# Altium project Variable_resistance_plates.PrjPcb
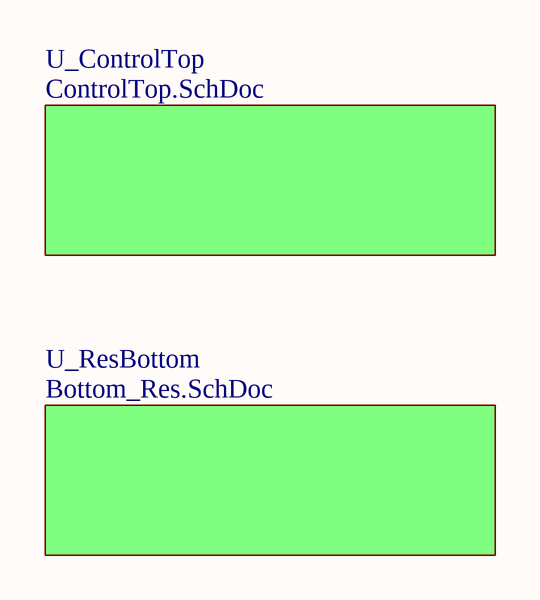
[diagram p0: All.SchDoc]
7 sheets, 187 parts. Net scope: hierarchical (ports join the sheet entries above them; power ports are global).
Board file: TopControl.PcbDoc
Sheets:
  All.SchDoc
    U_ControlTop = ControlTop.SchDoc
      U_MCU = MCU.SchDoc
      U_Power = Power.SchDoc
      Relay1 = Relay.SchDoc
      Relay2 = Relay.SchDoc
      Relay3 = Relay.SchDoc
      Relay4 = Relay.SchDoc
      Relay5 = Relay.SchDoc
      Relay6 = Relay.SchDoc
      Relay7 = Relay.SchDoc
      Relay8 = Relay.SchDoc
      U_Port = Port.SchDoc
    U_ResBottom = Bottom_Res.SchDoc

## Sheet All.SchDoc
size A4; SheetNumber: 1; SheetTotal: 7

### Sub-sheets
U_ControlTop = ControlTop.SchDoc: no entries
U_ResBottom = Bottom_Res.SchDoc: no entries

## Sheet ControlTop.SchDoc
size A4; SheetNumber: 2; SheetTotal: 8
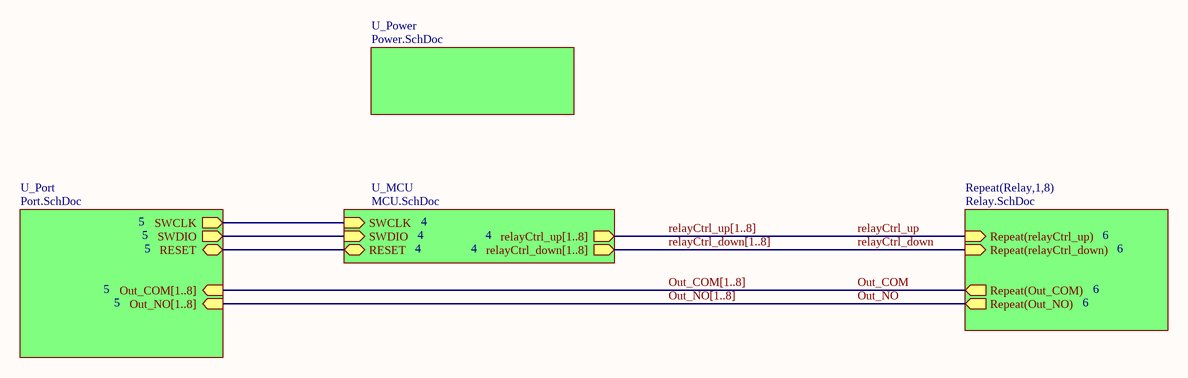
[diagram p1: ControlTop.SchDoc]

### Sub-sheets
Repeat(Relay,1,8) = Relay.SchDoc: Repeat(Out_COM) (out), Repeat(Out_NO) (out), Repeat(relayCtrl_up) (in), Repeat(relayCtrl_down) (in)
U_MCU = MCU.SchDoc: SWDIO (in), SWCLK (in), RESET (bidir), relayCtrl_up[1..8] (out), relayCtrl_down[1..8] (out)
U_Port = Port.SchDoc: SWCLK (out), SWDIO (out), RESET (bidir), Out_NO[1..8] (in), Out_COM[1..8] (in)
U_Power = Power.SchDoc: no entries

### Nets
Out_COM: sheet Repeat(Relay,1,8)/Repeat(Out_COM)
Out_NO: sheet Repeat(Relay,1,8)/Repeat(Out_NO)
relayCtrl_down: sheet Repeat(Relay,1,8)/Repeat(relayCtrl_down)
relayCtrl_up: sheet Repeat(Relay,1,8)/Repeat(relayCtrl_up)
RESET: sheet U_MCU/RESET, sheet U_Port/RESET
SWCLK: sheet U_MCU/SWCLK, sheet U_Port/SWCLK
SWDIO: sheet U_MCU/SWDIO, sheet U_Port/SWDIO

### Buses and harness runs
bus Out_COM[1..8] = sheet U_Port/Out_COM[1..8]
bus Out_NO[1..8] = sheet U_Port/Out_NO[1..8]
bus relayCtrl_down[1..8] = sheet U_MCU/relayCtrl_down[1..8]
bus relayCtrl_up[1..8] = sheet U_MCU/relayCtrl_up[1..8]

## Sheet MCU.SchDoc
size A4; SheetNumber: 4; SheetTotal: 8
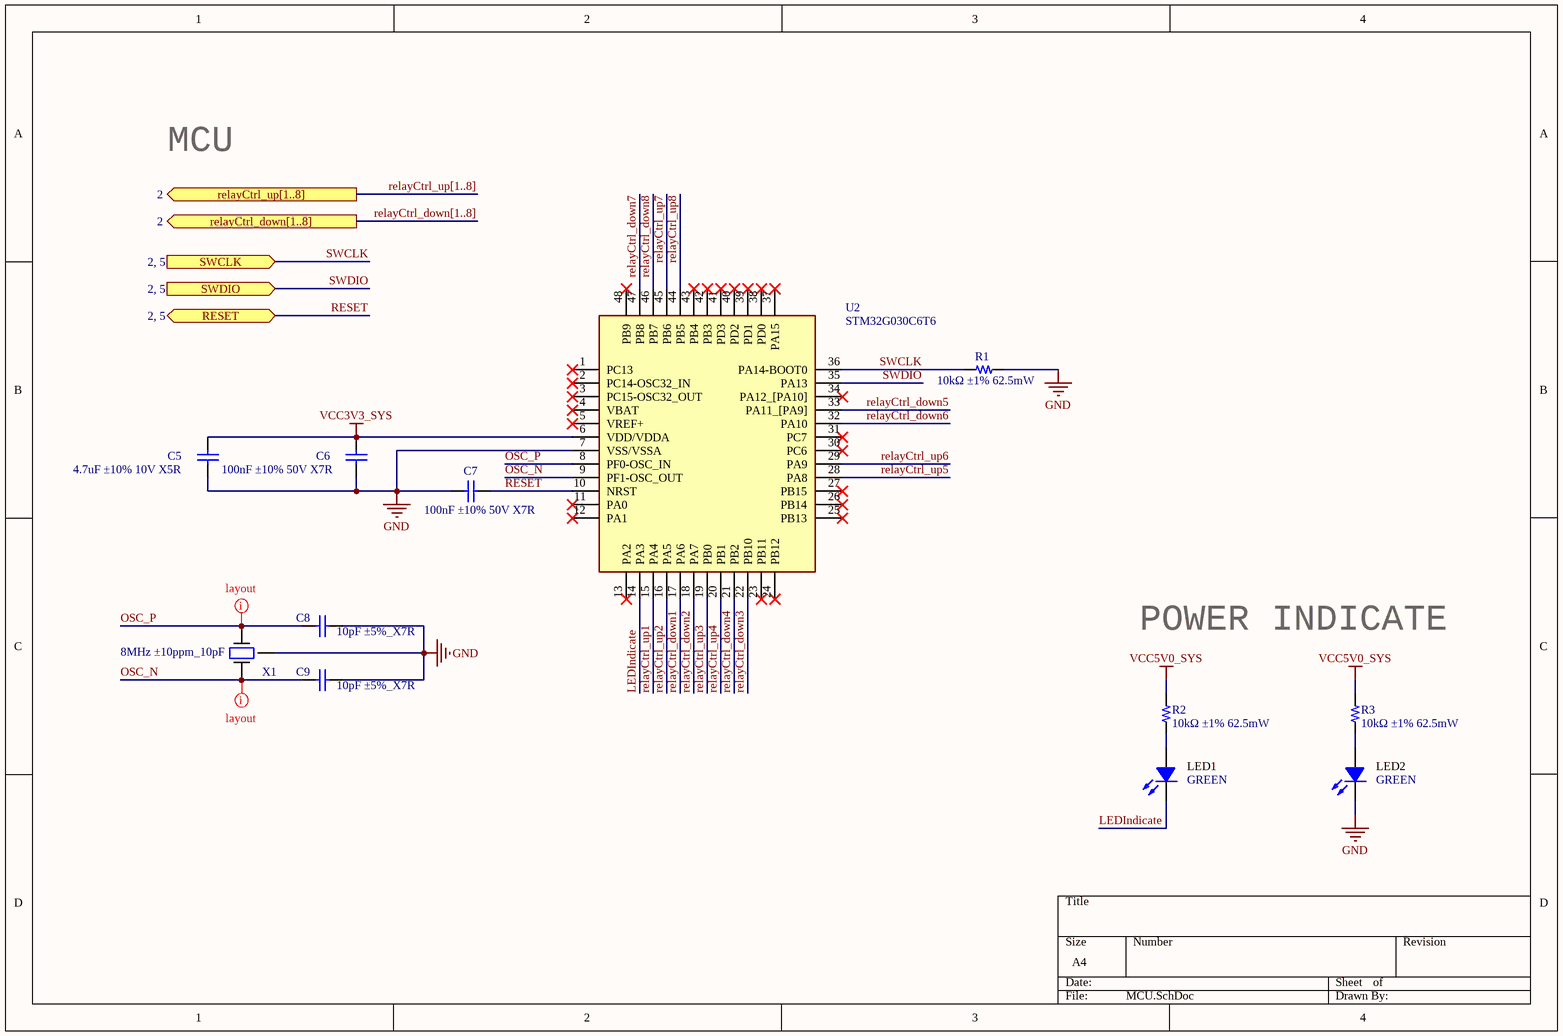
[diagram p2: MCU.SchDoc]

### Parts
C5  4.7uF ±10% 10V X5R  [C0402]
C6  100nF ±10% 50V X7R  [C0402]
C7  100nF ±10% 50V X7R  [C0402]
C8  10pF ±5%_X7R  [C0402]
C9  10pF ±5%_X7R  [C0402]
LED1  GREEN  [LED0603-RD]
LED2  GREEN  [LED0603-RD]
R1  10kΩ ±1% 62.5mW  [R0402]
R2  10kΩ ±1% 62.5mW  [R0402]
R3  10kΩ ±1% 62.5mW  [R0402]
U2  STM32G030C6T6  [QFP50P900X900X160-48N]
X1  8MHz ±10ppm_10pF  [CRYSTAL_3225]

### Ports
relayCtrl_down[1..8] (out, see 2), relayCtrl_up[1..8] (out, see 2), RESET (bidir, see 2, 5), SWCLK (in, see 2, 5), SWDIO (in, see 2, 5)

### Nets
GND: C5.1 C6.1 C7.1 C8.2 C9.2 LED2.2(K) R1.1 U2.7(VSS/VSSA) X1.G
VCC3V3_SYS: C5.2 C6.2 U2.6(VDD/VDDA)
VCC5V0_SYS: R2.1 R3.1
LEDIndicate: LED1.2(K) U2.14(PA3)  [project net LEDIndicate_4]
OSC_N: C9.1 U2.9(PF1-OSC_OUT) X1.1  [project net OSC_N_4]
OSC_P: C8.1 U2.8(PF0-OSC_IN) X1.3  [project net OSC_P_4]
relayCtrl_down1: U2.17(PA6)  [project net relayCtrl_down]
relayCtrl_down2: U2.18(PA7)  [project net relayCtrl_down]
relayCtrl_down3: U2.22(PB10)  [project net relayCtrl_down]
relayCtrl_down4: U2.21(PB2)  [project net relayCtrl_down]
relayCtrl_down5: U2.33(PA11_[PA9])  [project net relayCtrl_down]
relayCtrl_down6: U2.32(PA10)  [project net relayCtrl_down]
relayCtrl_down7: U2.47(PB8)  [project net relayCtrl_down]
relayCtrl_down8: U2.46(PB7)  [project net relayCtrl_down]
relayCtrl_up1: U2.15(PA4)  [project net relayCtrl_up]
relayCtrl_up2: U2.16(PA5)  [project net relayCtrl_up]
relayCtrl_up3: U2.19(PB0)  [project net relayCtrl_up]
relayCtrl_up4: U2.20(PB1)  [project net relayCtrl_up]
relayCtrl_up5: U2.28(PA8)  [project net relayCtrl_up]
relayCtrl_up6: U2.29(PA9)  [project net relayCtrl_up]
relayCtrl_up7: U2.45(PB6)  [project net relayCtrl_up]
relayCtrl_up8: U2.44(PB5)  [project net relayCtrl_up]
RESET: C7.2 U2.10(NRST) ; port RESET
SWCLK: R1.2 U2.36(PA14-BOOT0) ; port SWCLK
SWDIO: U2.35(PA13) ; port SWDIO
NetLED1_1: LED1.1(A) R2.2
NetLED2_1: LED2.1(A) R3.2

Not connected (* = marked no-connect by the designer): U2 1(PC13)* 2(PC14-OSC32_IN)* 3(PC15-OSC32_OUT)* 4(VBAT)* 5(VREF+)* 11(PA0)* 12(PA1)* 13(PA2)* 23(PB11)* 24(PB12)* 25(PB13)* 26(PB14)* 27(PB15)* 30(PC6)* 31(PC7)* 34(PA12_[PA10])* 37(PA15)* 38(PD0)* 39(PD1)* 40(PD2)* 41(PD3)* 42(PB3)* 43(PB4)* 48(PB9)*

### Buses and harness runs
bus relayCtrl_down[1..8] = port relayCtrl_down[1..8]
bus relayCtrl_up[1..8] = port relayCtrl_up[1..8]

### Layout directives
mark named layout: OSC_N_4, OSC_P_4

### Notes on the sheet
- MCU
- POWER INDICATE

### Library data of the parts
C5 = Cap: CL05A475KP5NRNC; Published: 8-Jun-2000; LatestRevisionDate: 17-Jul-2002; LatestRevisionNote: Re-released for DXP Platform.; PackageReference: RAD-0.3; Publisher: Altium Limited; PackageDescription: Radial Cap, Thru-Hole; 2 Leads; 0.3 in Pin Spacing
C6 C7 = Cap: CL05B104KO5NNNC; Published: 8-Jun-2000; LatestRevisionDate: 17-Jul-2002; LatestRevisionNote: Re-released for DXP Platform.; PackageReference: RAD-0.3; Publisher: Altium Limited; PackageDescription: Radial Cap, Thru-Hole; 2 Leads; 0.3 in Pin Spacing
C8 C9 = Cap: Capacitor; Published: 8-Jun-2000; LatestRevisionDate: 17-Jul-2002; LatestRevisionNote: Re-released for DXP Platform.; PackageReference: RAD-0.3; Publisher: Altium Limited; PackageDescription: Radial Cap, Thru-Hole; 2 Leads; 0.3 in Pin Spacing
LED1 LED2 = LED: 发光颜色:; Manufacturer: EVERLIGHT(亿光); Name: 17-21SURC/S530-A2/TR8; Add into BOM: yes; Emitted Color: 红灯; Symbol: 17-21SURC/S530-A2/TR8; Device: 17-21SURC/S530-A2/TR8; LCSC Part Name: 红灯; Supplier Part: C131244; Manufacturer Part: 17-21SURC/S530-A2/TR8; Supplier Footprint: 0805; JLCPCB Part Class: Extended Part; Datasheet: https://atta.szlcsc.com/upload/public/pdf/source/20170918/C131244_1505726880590976254.pdf; Supplier: LCSC; Convert to PCB: yes
R1-R3 = R-0603: 0402WGF1002TCE
U2 = STM32G030C6T6: Integrated Circuit; Manufacturer_Name: STMicroelectronics; Datasheet Link: https://datasheet.datasheetarchive.com/originals/distributors/Datasheets_SAMA/41d698f2d3eefcd1331311559e90da5e.pdf; Height: 1.6mm; Manufacturer_Part_Number: STM32G030C6T6; Mouser Part Number: 511-STM32G030C6T6; Mouser Price/Stock: https://www.mouser.co.uk/ProductDetail/STMicroelectronics/STM32G030C6T6?qs=uwxL4vQweFNhONHhoas%2FMg%3D%3D; Arrow Part Number: STM32G030C6T6; Arrow Price/Stock: https://www.arrow.com/en/products/stm32g030c6t6/stmicroelectronics?utm_currency=USD&region=nac
X1 = CRYSTAL: Crystal 8MHz ±10ppm 10pF 200 Ohm -10°C ~ 60°C Surface Mount 4-SMD, No Lead (DFN, LCC); Manufacturer: Abracon LLC; Manufacturer Part Number: ABM3B-8.000MHZ-10-1-U-T; Operating Mode: Fundamental; Supplier 1: Digi-Key; Supplier Part Number 1: 535-9721-1-ND; RoHS: RoHS Compliant; Category: Crystals, Oscillators, Resonators; Stock: 35437; Pricing 1: 1=0.69, 10=0.578, 50=0.5198, 100=0.462, 500=0.4389 (USD); Packaging: Cut Tape (CT); Part Status: Active; Type: MHz Crystal; Frequency Stability: ±10ppm; Frequency Tolerance: ±10ppm; Load Capacitance: 10pF; Operating Temperature: -10°C ~ 60°C; Ratings: -; Mounting Type: Surface Mount; Package / Case: 4-SMD, No Lead; Size / Dimension: 0.197" L x 0.126" W (5.00mm x 3.20mm); Height - Seated (Max): 0.043" (1.10mm); ComponentLink1URL: http://www.abracon.com/Resonators/abm3b.pdf; ComponentLink1Description: http://www.abracon.com/Resonators/abm3b.pdf; Supplier 2: Digi-Key; Supplier Part Number 2: 535-9721-2-ND; Pricing 2: 1000=0.336, 3000=0.315, 5000=0.3045, 10000=0.294 (USD)

## Sheet Power.SchDoc
size A4; SheetNumber: 3; SheetTotal: 8
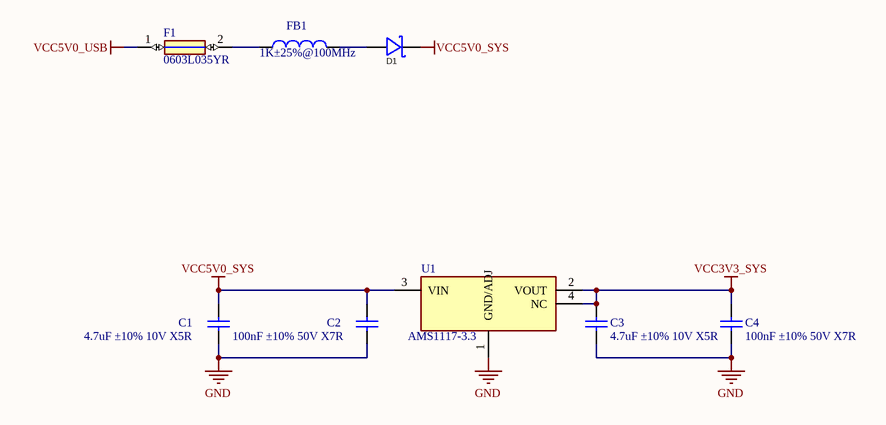
[diagram p3: Power.SchDoc]

### Parts
C1  4.7uF ±10% 10V X5R  [C0402]
C2  100nF ±10% 50V X7R  [C0402]
C3  4.7uF ±10% 10V X5R  [C0402]
C4  100nF ±10% 50V X7R  [C0402]
D1  B340A-13-F  [SMA_L4.4-W2.6-LS5.0-RD]  (value not drawn)
F1  0603L035YR  [FUSC1608X75N]
FB1  1K±25%@100MHz  [BLM18SP221SN1B]
U1  AMS1117-3.3  [SOT-223-4_L6.5-W3.5-P2.30-LS7.0-BR]

### Nets
GND: C1.1 C2.1 C3.1 C4.1 U1.1(GND/ADJ)
VCC3V3_SYS: C3.2 C4.2 U1.2(VOUT) U1.4(NC)
VCC5V0_SYS: C1.2 C2.2 D1.1(K) U1.3(VIN)
VCC5V0_USB: F1.1
NetD1_2: D1.2(A) FB1.2
NetF1_2: F1.2 FB1.1

### Library data of the parts
C1 C3 = Cap: CL05A475KP5NRNC; Published: 8-Jun-2000; LatestRevisionDate: 17-Jul-2002; LatestRevisionNote: Re-released for DXP Platform.; PackageReference: RAD-0.3; Publisher: Altium Limited; PackageDescription: Radial Cap, Thru-Hole; 2 Leads; 0.3 in Pin Spacing
C2 C4 = Cap: CL05B104KO5NNNC; Published: 8-Jun-2000; LatestRevisionDate: 17-Jul-2002; LatestRevisionNote: Re-released for DXP Platform.; PackageReference: RAD-0.3; Publisher: Altium Limited; PackageDescription: Radial Cap, Thru-Hole; 2 Leads; 0.3 in Pin Spacing
D1 = Diode_Schottky: 直流反向耐压(Vr):40V;平均整流电流(Io):3A;正向压降(Vf):500mV@3A;; Manufacturer: DIODES(美台); Add into BOM: yes; Reverse Voltage (Vr): 40V; Average Rectified Current (Io): 3A; Name: B340A-13-F; Symbol: B340A-13-F; Device: B340A-13-F; LCSC Part Name: 40V 3A 500mV@3A; Supplier Part: C85098; Manufacturer Part: B340A-13-F; Supplier Footprint: SMA(DO-214AC); JLCPCB Part Class: 扩展库; Datasheet: https://atta.szlcsc.com/upload/public/pdf/source/20171023/C134454_15087453575121052549.pdf; Supplier: LCSC; Convert to PCB: yes; Forward Voltage (Vf@If): 500mV@3A
F1 = 0603L035YR: Fuse; Manufacturer_Name: LITTELFUSE; Datasheet Link: https://www.littelfuse.com/~/media/electronics/datasheets/resettable_ptcs/littelfuse_ptc_0603l_datasheet.pdf.pdf; Height: 0.75mm; Manufacturer_Part_Number: 0603L035YR; Mouser Part Number: 576-0603L035YR; Mouser Price/Stock: https://www.mouser.co.uk/ProductDetail/Littelfuse/0603L035YR?qs=PalBzRKzfnvD8ztzU42n%2Fw%3D%3D; Arrow Part Number: 0603L035YR; Arrow Price/Stock: https://www.arrow.com/en/products/0603l035yr/littelfuse?region=europe
FB1 = Inductor: BLM21AG102SN1D; Code_IEC: 1005; Value: 10uH; Published: 8-Jun-2000; LatestRevisionDate: 29-May-2009; LatestRevisionNote: IPC-7351 Footprint Added.; PackageReference: 0402-A; Publisher: Altium Limited; PackageDescription: Chip Inductor; Code_JEITA: 0402
U1 = AMS1117-3.3: Integrated Circuit; Manufacturer_Name: Advanced; Datasheet Link: https://datasheet.datasheetarchive.com/originals/distributors/Datasheets-28/DSA-550594.pdf; Height: 1.8mm; Manufacturer_Part_Number: AMS1117-3.3

## Sheet Relay.SchDoc
size A4; SheetNumber: 6; SheetTotal: 8
Used 8 times, as channels U_ControlTop/Relay1, U_ControlTop/Relay2, U_ControlTop/Relay3, U_ControlTop/Relay4, U_ControlTop/Relay5, U_ControlTop/Relay6, U_ControlTop/Relay7, U_ControlTop/Relay8. Parts and nets are listed once, with the designators drawn on the sheet.
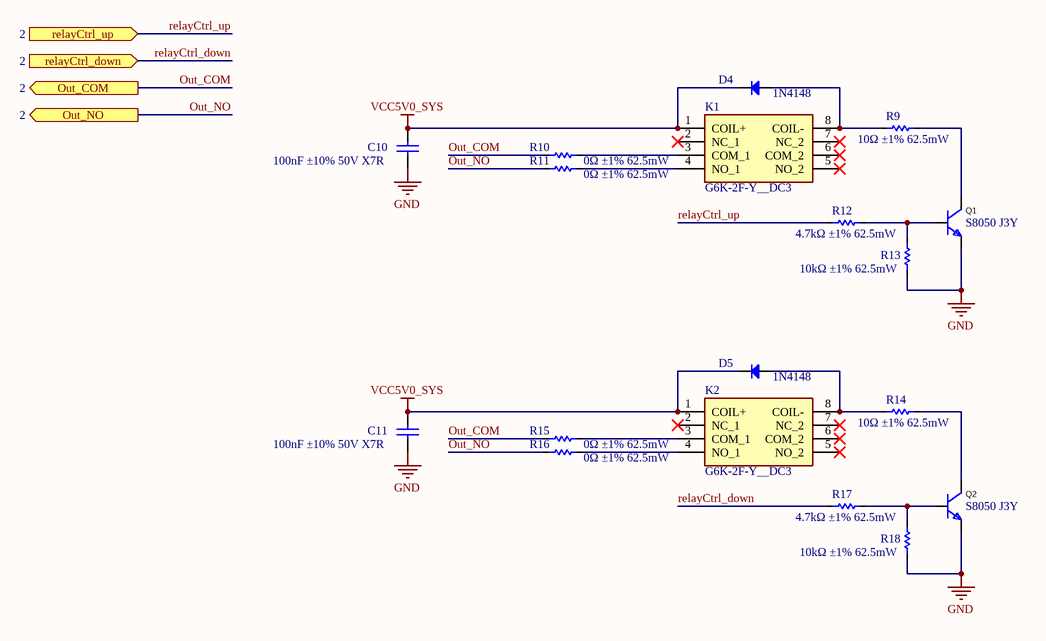
[diagram p4: Relay.SchDoc]

### Parts
C10  100nF ±10% 50V X7R  [C0603]
C11  100nF ±10% 50V X7R  [C0603]
D4  1N4148  [SMA_L4.3-W2.6-LS5.2-RD]
D5  1N4148  [SMA_L4.3-W2.6-LS5.2-RD]
K1  G6K-2F-Y__DC3  [G6K2FYDC3]
K2  G6K-2F-Y__DC3  [G6K2FYDC3]
Q1  S8050 J3Y  [SOT95P240X110-3N]
Q2  S8050 J3Y  [SOT95P240X110-3N]
R9  10Ω ±1% 62.5mW  [R0402]
R10  0Ω ±1% 62.5mW  [R0402]
R11  0Ω ±1% 62.5mW  [R0402]
R12  4.7kΩ ±1% 62.5mW  [R0402]
R13  10kΩ ±1% 62.5mW  [R0402]
R14  10Ω ±1% 62.5mW  [R0402]
R15  0Ω ±1% 62.5mW  [R0402]
R16  0Ω ±1% 62.5mW  [R0402]
R17  4.7kΩ ±1% 62.5mW  [R0402]
R18  10kΩ ±1% 62.5mW  [R0402]

### Ports
Out_COM (out, see 2), Out_NO (out, see 2), relayCtrl_down (in, see 2), relayCtrl_up (in, see 2)

### Nets
GND: C10.1 C11.1 Q1.2(E) Q2.2(E) R13.1 R18.1
VCC5V0_SYS: C10.2 C11.2 D4.2(K) D5.2(K) K1.1(COIL+) K2.1(COIL+)
Out_COM: R10.2 R15.2 ; port Out_COM
Out_NO: R11.2 R16.2 ; port Out_NO
relayCtrl_down: R17.1 ; port relayCtrl_down
relayCtrl_up: R12.1 ; port relayCtrl_up
NetD4_1: D4.1(A) K1.8(COIL-) R9.2
NetD5_1: D5.1(A) K2.8(COIL-) R14.2
NetK1_3: K1.3(COM_1) R10.1
NetK1_4: K1.4(NO_1) R11.1
NetK2_3: K2.3(COM_1) R15.1
NetK2_4: K2.4(NO_1) R16.1
NetQ1_1: Q1.1(B) R12.2 R13.2
NetQ1_3: Q1.3(C) R9.1
NetQ2_1: Q2.1(B) R17.2 R18.2
NetQ2_3: Q2.3(C) R14.1

Not connected (* = marked no-connect by the designer): K1 2(NC_1)* 5(NO_2)* 6(COM_2)* 7(NC_2)*; K2 2(NC_1)* 5(NO_2)* 6(COM_2)* 7(NC_2)*

### Channels
U_ControlTop/Relay1: designators C10=C10_Relay1 C11=C11_Relay1 D4=D4_Relay1 D5=D5_Relay1 K1=K? K2=K2_Relay1 Q1=Q1_Relay1 Q2=Q2_Relay1 R9=R9_Relay1 R10=R10_Relay1 R11=R11_Relay1 R12=R12_Relay1 R13=R13_Relay1 R14=R14_Relay1 R15=R15_Relay1 R16=R16_Relay1 R17=R17_Relay1 R18=R18_Relay1; ports Out_COM=Out_COM Out_NO=Out_NO relayCtrl_down=relayCtrl_down relayCtrl_up=relayCtrl_up
U_ControlTop/Relay2: designators end in _Relay2; ports Out_COM=Out_COM Out_NO=Out_NO relayCtrl_down=relayCtrl_down relayCtrl_up=relayCtrl_up
U_ControlTop/Relay3: designators end in _Relay3; ports Out_COM=Out_COM Out_NO=Out_NO relayCtrl_down=relayCtrl_down relayCtrl_up=relayCtrl_up
U_ControlTop/Relay4: designators end in _Relay4; ports Out_COM=Out_COM Out_NO=Out_NO relayCtrl_down=relayCtrl_down relayCtrl_up=relayCtrl_up
U_ControlTop/Relay5: designators end in _Relay5; ports Out_COM=Out_COM Out_NO=Out_NO relayCtrl_down=relayCtrl_down relayCtrl_up=relayCtrl_up
U_ControlTop/Relay6: designators end in _Relay6; ports Out_COM=Out_COM Out_NO=Out_NO relayCtrl_down=relayCtrl_down relayCtrl_up=relayCtrl_up
U_ControlTop/Relay7: designators end in _Relay7; ports Out_COM=Out_COM Out_NO=Out_NO relayCtrl_down=relayCtrl_down relayCtrl_up=relayCtrl_up
U_ControlTop/Relay8: designators end in _Relay8; ports Out_COM=Out_COM Out_NO=Out_NO relayCtrl_down=relayCtrl_down relayCtrl_up=relayCtrl_up

### Library data of the parts
C10 C11 = C0603: CC0603KRX7R9BB104; Published: 8-Jun-2000; LatestRevisionDate: 17-Jul-2002; LatestRevisionNote: Re-released for DXP Platform.; PackageReference: RAD-0.3; Publisher: Altium Limited; PackageDescription: Radial Cap, Thru-Hole; 2 Leads; 0.3 in Pin Spacing
D4 D5 = Diode: High Conductance Fast Diode; Published: 8-Jun-2000; LatestRevisionDate: 17-Jul-2002; LatestRevisionNote: Re-released for DXP Platform.; DatasheetVersion: 1997; PackageReference: DO-35; Publisher: Altium Limited; PackageDescription: Diode, Axial; Body 3.8 x 1.9 mm (LxDia. max), Lead Dia. 0.53 mm (max); Code_JEDEC: DO-204-AH; ComponentLink1Description: Manufacturer Link; ComponentLink1URL: http://www.fairchildsemi.com/; ComponentLink2Description: Datasheet; ComponentLink2URL: http://www.fairchildsemi.com/ds/1N%2F1N4148.pdf
K1 K2 = G6K-2F-Y__DC3: Relay or Contactor; Manufacturer_Name: Omron Electronics; Manufacturer_Part_Number: G6K-2F-Y  DC3; Datasheet Link: https://omronfs.omron.com/en_US/ecb/products/pdf/en-g6k.pdf; Height: 5.4mm
Q1 Q2 = S8050: Manufacturer: CJ(江苏长电/长晶); Name: SS8050; Symbol: SS8050_C2150; Add into BOM: yes; Transistor Type: NPN; Collector-Emitter Breakdown Voltage (Vceo): 25V; Collector Current (Ic): 1.5A; Power Dissipation (Pd): 300mW; Collector Cut-Off Current (Icbo): 100nA; Collector-Emitter Saturation Voltage (VCE(sat)@Ic,Ib): 500mV@800mA,80mA; DC Current Gain (hFE@Ic,Vce): 200@100mA,1V; Transition Frequency (fT): 100MHz; Device: SS8050_C2150; LCSC Part Name: NPN 25V 1.5A Y1 200-350; Supplier Part: C2150; Manufacturer Part: SS8050; Supplier Footprint: SOT-23; JLCPCB Part Class: Basic Part; Datasheet: https://atta.szlcsc.com/upload/public/pdf/source/20230322/AEE86F4B043774EFF80CAEA14A37D9E9.pdf; Supplier: LCSC; Convert to PCB: yes; Operating Temperature: +150℃@(Tj)
R9-R18 = R0402: Resistor; Published: 8-Jun-2000; LatestRevisionDate: 17-Jul-2002; LatestRevisionNote: Re-released for DXP Platform.; PackageReference: AXIAL-0.3; Publisher: Altium Limited; PackageDescription: Axial Device, Thru-Hole; 2 Leads; 0.3 in Pin Spacing

## Sheet Port.SchDoc
size A4; SheetNumber: 5; SheetTotal: 8
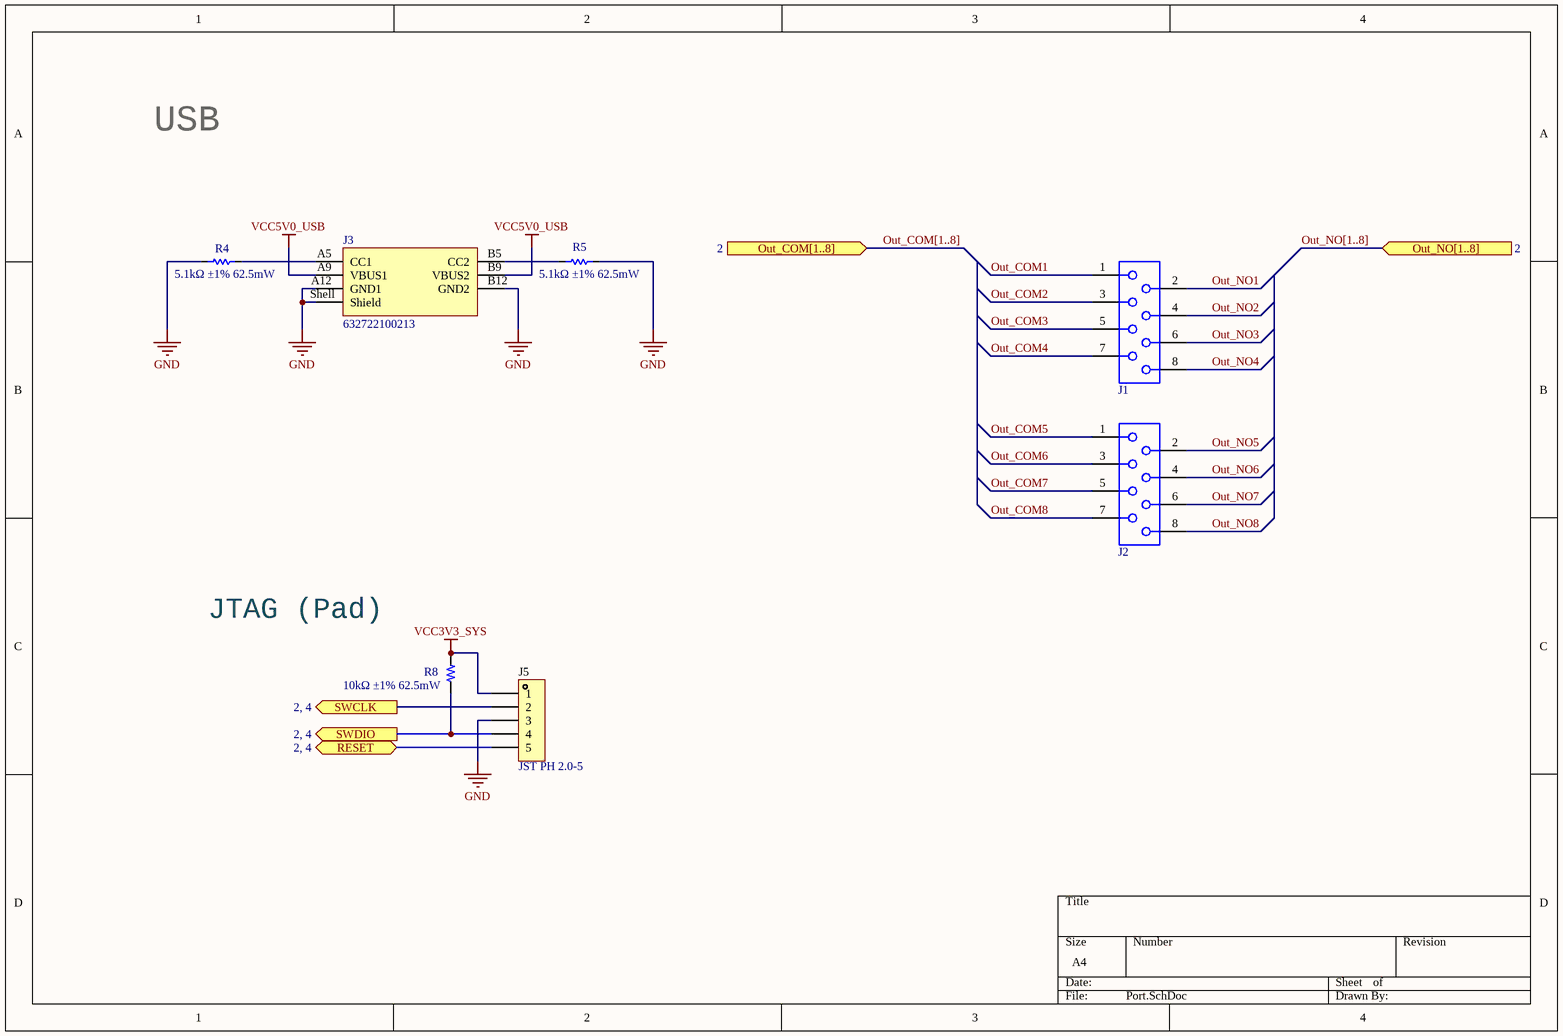
[diagram p5: Port.SchDoc]

### Parts
J1  690367290876  [690367290876]  (value not drawn)
J2  690367290876  [690367290876]  (value not drawn)
J3  632722100213  [632722100213]
J5  JST PH 2.0-5  [CONN-TH_B5B-PH-K-S-LF-SN]
R4  5.1kΩ ±1% 62.5mW  [R0402]
R5  5.1kΩ ±1% 62.5mW  [R0402]
R8  10kΩ ±1% 62.5mW  [R0402]

### Ports
Out_COM[1..8] (in, see 2), Out_NO[1..8] (in, see 2), RESET (bidir, see 2, 4), SWCLK (out, see 2, 4), SWDIO (out, see 2, 4)

### Nets
GND: J3.A12(GND1) J3.B12(GND2) J3.Shell(Shield) J5.3 R4.1 R5.2
VCC3V3_SYS: J5.1 R8.2
VCC5V0_USB: J3.A9(VBUS1) J3.B9(VBUS2)
Out_COM1: J1.1  [project net Out_COM]
Out_COM2: J1.3  [project net Out_COM]
Out_COM3: J1.5  [project net Out_COM]
Out_COM4: J1.7  [project net Out_COM]
Out_COM5: J2.1  [project net Out_COM]
Out_COM6: J2.3  [project net Out_COM]
Out_COM7: J2.5  [project net Out_COM]
Out_COM8: J2.7  [project net Out_COM]
Out_NO1: J1.2  [project net Out_NO]
Out_NO2: J1.4  [project net Out_NO]
Out_NO3: J1.6  [project net Out_NO]
Out_NO4: J1.8  [project net Out_NO]
Out_NO5: J2.2  [project net Out_NO]
Out_NO6: J2.4  [project net Out_NO]
Out_NO7: J2.6  [project net Out_NO]
Out_NO8: J2.8  [project net Out_NO]
RESET: J5.5 ; port RESET
SWCLK: J5.2 ; port SWCLK
SWDIO: J5.4 R8.1 ; port SWDIO
NetJ3_A5: J3.A5(CC1) R4.2
NetJ3_B5: J3.B5(CC2) R5.1

### Buses and harness runs
bus Out_COM[1..8] = port Out_COM[1..8]
bus Out_NO[1..8] = port Out_NO[1..8]

### Notes on the sheet
- USB
- JTAG (Pad)

### Library data of the parts
J1 J2 = 690367290876: WR-MM Mini Module Connector, Female, SMT, with Latch & Polarization, Straight, pitch 2.54mm, 8p; Manufacturer: Wurth Elektronik; Contact Resistance: 10mΩ; Insulation Resistance: 1000MΩ; Rated Current: 1.5A; Working Voltage: 250VAC; Withstanding Voltage: 500VAC; ComponentLink1Description: Website Link; ComponentLink1URL: https://www.we-online.com/redexpert/article/690367290876?ad; ComponentLink2Description: Datasheet Link; ComponentLink2URL: https://www.we-online.com/redexpert/spec/690367290876?ad; Manufacturer Part Number: 690367290876; Category: Board-to-Board Connectors; Match Code: WR-MM; Mount: Surface Mount; Operating Temperature Max: 105°C; Operating Temperature Min: -40°C; Packaging: Tape and Reel; Length: 14.76mm; Gender: Female; Number of Pins: 8; Orientation: Straight; Pitch: 2.54mm
J3 = 632722100213: WR-COM USB Power Delivery Type C Receptacle Horizontal SMT; Manufacturer: Wurth Elektronik; Match Code: WR-USB; Number of Ports: 1; Rated Current: 5; Working Voltage: 48V (DC); Manufacturer Part Number: 632722100213; Category: Input/Output Connectors; ComponentLink1Description: Website Link; ComponentLink1URL: https://www.we-online.com/redexpert/article/632722100213?ad; ComponentLink2Description: Datasheet Link; ComponentLink2URL: https://www.we-online.com/redexpert/spec/632722100213?ad; Mount: Surface Mount; Min Operating Temperature: -40°C; Max Operating Temperature: 85°C; Packaging: Tape and Reel; Application: USB Power Delivery; Gender: Receptacle; Number of Pins: 6; Orientation: Horizontal
J5 = PH2.0-5P: B5B-PH-K-S; Manufacturer: BOOMELE(博穆精密); Name: GH1.25-5PLTPZ; Add into BOM: yes; Symbol: GH1.25-5PLTPZ; Device: GH1.25-5PLTPZ; LCSC Part Name: GH1.25-5P立贴编带加盖; Supplier Part: C2829263; Manufacturer Part: GH1.25-5PLTPZ; Supplier Footprint: -; JLCPCB Part Class: Extended Part; Datasheet: https://atta.szlcsc.com/upload/public/pdf/source/20211125/08A09A4909F58AF780B71FE423A00F7E.pdf; Supplier: LCSC; Convert to PCB: yes
R4 R5 = Res: Resistor; Published: 8-Jun-2000; LatestRevisionDate: 17-Jul-2002; LatestRevisionNote: Re-released for DXP Platform.; PackageReference: AXIAL-0.3; Publisher: Altium Limited; PackageDescription: Axial Device, Thru-Hole; 2 Leads; 0.3 in Pin Spacing
R8 = R-0603: 0402WGF1002TCE

## Sheet Bottom_Res.SchDoc
size A4; SheetNumber: 7; SheetTotal: 7
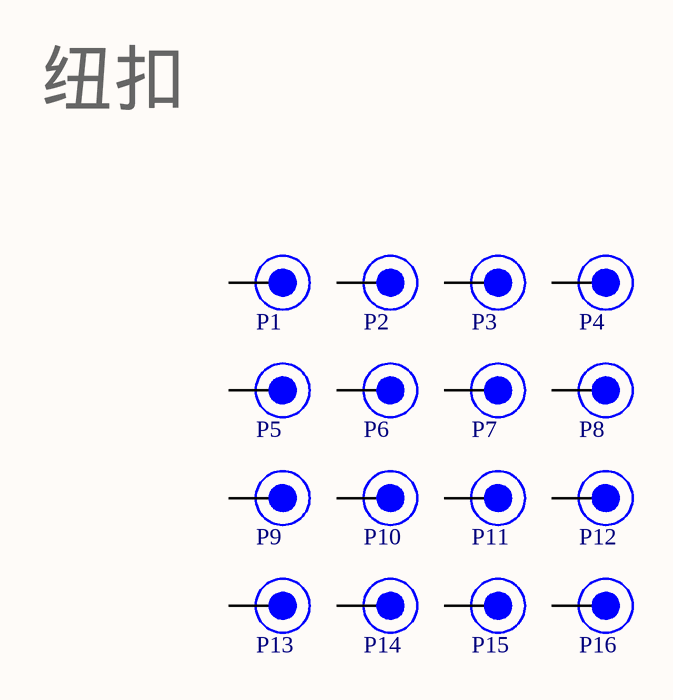
[diagram p6: Bottom_Res.SchDoc]

### Parts
P1  11mm Pad  [11mm Pad]  (value not drawn)
P2  11mm Pad  [11mm Pad]  (value not drawn)
P3  11mm Pad  [11mm Pad]  (value not drawn)
P4  11mm Pad  [11mm Pad]  (value not drawn)
P5  11mm Pad  [11mm Pad]  (value not drawn)
P6  11mm Pad  [11mm Pad]  (value not drawn)
P7  11mm Pad  [11mm Pad]  (value not drawn)
P8  11mm Pad  [11mm Pad]  (value not drawn)
P9  11mm Pad  [11mm Pad]  (value not drawn)
P10  11mm Pad  [11mm Pad]  (value not drawn)
P11  11mm Pad  [11mm Pad]  (value not drawn)
P12  11mm Pad  [11mm Pad]  (value not drawn)
P13  11mm Pad  [11mm Pad]  (value not drawn)
P14  11mm Pad  [11mm Pad]  (value not drawn)
P15  11mm Pad  [11mm Pad]  (value not drawn)
P16  11mm Pad  [11mm Pad]  (value not drawn)

### Nets

Not connected (* = marked no-connect by the designer): P1 1; P2 1; P3 1; P4 1; P5 1; P6 1; P7 1; P8 1; P9 1; P10 1; P11 1; P12 1; P13 1; P14 1; P15 1; P16 1

### Notes on the sheet
- 纽扣

### Library data of the parts
P1-P16 = 11mm Pad: TestPad_SMD

## Nets that join several sheets
GND: MCU (9 pins), Power (5 pins), U_ControlTop/Relay1 (6 pins), U_ControlTop/Relay2 (6 pins), U_ControlTop/Relay3 (6 pins), U_ControlTop/Relay4 (6 pins), U_ControlTop/Relay5 (6 pins), U_ControlTop/Relay6 (6 pins), U_ControlTop/Relay7 (6 pins), U_ControlTop/Relay8 (6 pins), Port (6 pins)
VCC3V3_SYS: MCU (C5.2 C6.2 U2.6), Power (C3.2 C4.2 U1.2 U1.4), Port (J5.1 R8.2)
VCC5V0_SYS: MCU (R2.1 R3.1), Power (C1.2 C2.2 D1.1 U1.3), U_ControlTop/Relay1 (6 pins), U_ControlTop/Relay2 (6 pins), U_ControlTop/Relay3 (6 pins), U_ControlTop/Relay4 (6 pins), U_ControlTop/Relay5 (6 pins), U_ControlTop/Relay6 (6 pins), U_ControlTop/Relay7 (6 pins), U_ControlTop/Relay8 (6 pins)
VCC5V0_USB: Power (F1.1), Port (J3.A9 J3.B9)
Out_COM: U_ControlTop/Relay1 (R10_Relay1.2 R15_Relay1.2), Port (J1.1)
Out_COM: U_ControlTop/Relay2 (R10_Relay2.2 R15_Relay2.2), Port (J1.3)
Out_COM: U_ControlTop/Relay3 (R10_Relay3.2 R15_Relay3.2), Port (J1.5)
Out_COM: U_ControlTop/Relay4 (R10_Relay4.2 R15_Relay4.2), Port (J1.7)
Out_COM: U_ControlTop/Relay5 (R10_Relay5.2 R15_Relay5.2), Port (J2.1)
Out_COM: U_ControlTop/Relay6 (R10_Relay6.2 R15_Relay6.2), Port (J2.3)
Out_COM: U_ControlTop/Relay7 (R10_Relay7.2 R15_Relay7.2), Port (J2.5)
Out_COM: U_ControlTop/Relay8 (R10_Relay8.2 R15_Relay8.2), Port (J2.7)
Out_NO: U_ControlTop/Relay1 (R11_Relay1.2 R16_Relay1.2), Port (J1.2)
Out_NO: U_ControlTop/Relay2 (R11_Relay2.2 R16_Relay2.2), Port (J1.4)
Out_NO: U_ControlTop/Relay3 (R11_Relay3.2 R16_Relay3.2), Port (J1.6)
Out_NO: U_ControlTop/Relay4 (R11_Relay4.2 R16_Relay4.2), Port (J1.8)
Out_NO: U_ControlTop/Relay5 (R11_Relay5.2 R16_Relay5.2), Port (J2.2)
Out_NO: U_ControlTop/Relay6 (R11_Relay6.2 R16_Relay6.2), Port (J2.4)
Out_NO: U_ControlTop/Relay7 (R11_Relay7.2 R16_Relay7.2), Port (J2.6)
Out_NO: U_ControlTop/Relay8 (R11_Relay8.2 R16_Relay8.2), Port (J2.8)
relayCtrl_down: MCU (U2.17), U_ControlTop/Relay1 (R17_Relay1.1)
relayCtrl_down: MCU (U2.18), U_ControlTop/Relay2 (R17_Relay2.1)
relayCtrl_down: MCU (U2.21), U_ControlTop/Relay4 (R17_Relay4.1)
relayCtrl_down: MCU (U2.22), U_ControlTop/Relay3 (R17_Relay3.1)
relayCtrl_down: MCU (U2.33), U_ControlTop/Relay5 (R17_Relay5.1)
relayCtrl_down: MCU (U2.32), U_ControlTop/Relay6 (R17_Relay6.1)
relayCtrl_down: MCU (U2.47), U_ControlTop/Relay7 (R17_Relay7.1)
relayCtrl_down: MCU (U2.46), U_ControlTop/Relay8 (R17_Relay8.1)
relayCtrl_up: MCU (U2.15), U_ControlTop/Relay1 (R12_Relay1.1)
relayCtrl_up: MCU (U2.16), U_ControlTop/Relay2 (R12_Relay2.1)
relayCtrl_up: MCU (U2.19), U_ControlTop/Relay3 (R12_Relay3.1)
relayCtrl_up: MCU (U2.20), U_ControlTop/Relay4 (R12_Relay4.1)
relayCtrl_up: MCU (U2.29), U_ControlTop/Relay6 (R12_Relay6.1)
relayCtrl_up: MCU (U2.28), U_ControlTop/Relay5 (R12_Relay5.1)
relayCtrl_up: MCU (U2.45), U_ControlTop/Relay7 (R12_Relay7.1)
relayCtrl_up: MCU (U2.44), U_ControlTop/Relay8 (R12_Relay8.1)
RESET: MCU (C7.2 U2.10), Port (J5.5)
SWCLK: MCU (R1.2 U2.36), Port (J5.2)
SWDIO: MCU (U2.35), Port (J5.4 R8.1)